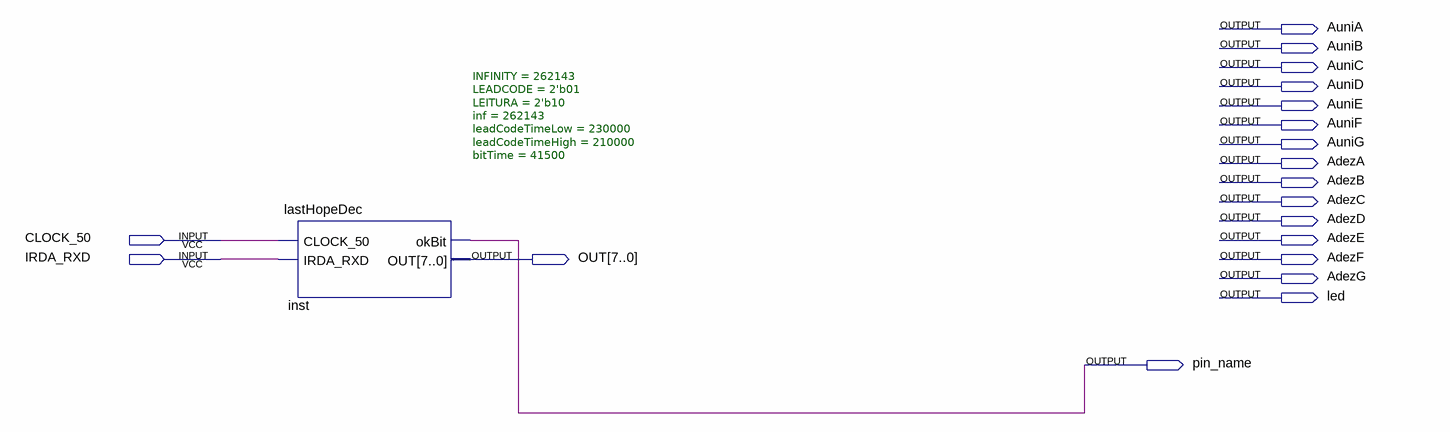
[diagram p0: schematic sheet]
// Quartus schematic main.bdf as structural Verilog: 1 symbols, 19 pins
module main (
  input  CLOCK_50,
  input  IRDA_RXD,
  output AuniA,
  output AuniB,
  output AuniC,
  output AuniD,
  output AuniE,
  output AuniF,
  output AuniG,
  output AdezA,
  output AdezB,
  output AdezC,
  output AdezD,
  output AdezE,
  output [7:0] OUT,
  output AdezF,
  output AdezG,
  output led,
  output pin_name
);

  lastHopeDec #(.INFINITY(262143), .LEADCODE(2'b01), .LEITURA(2'b10), .inf(262143), .leadCodeTimeLow(230000), .leadCodeTimeHigh(210000), .bitTime(41500)) inst (
    .CLOCK_50(CLOCK_50), .IRDA_RXD(IRDA_RXD), .okBit(pin_name), .OUT(OUT));
endmodule
